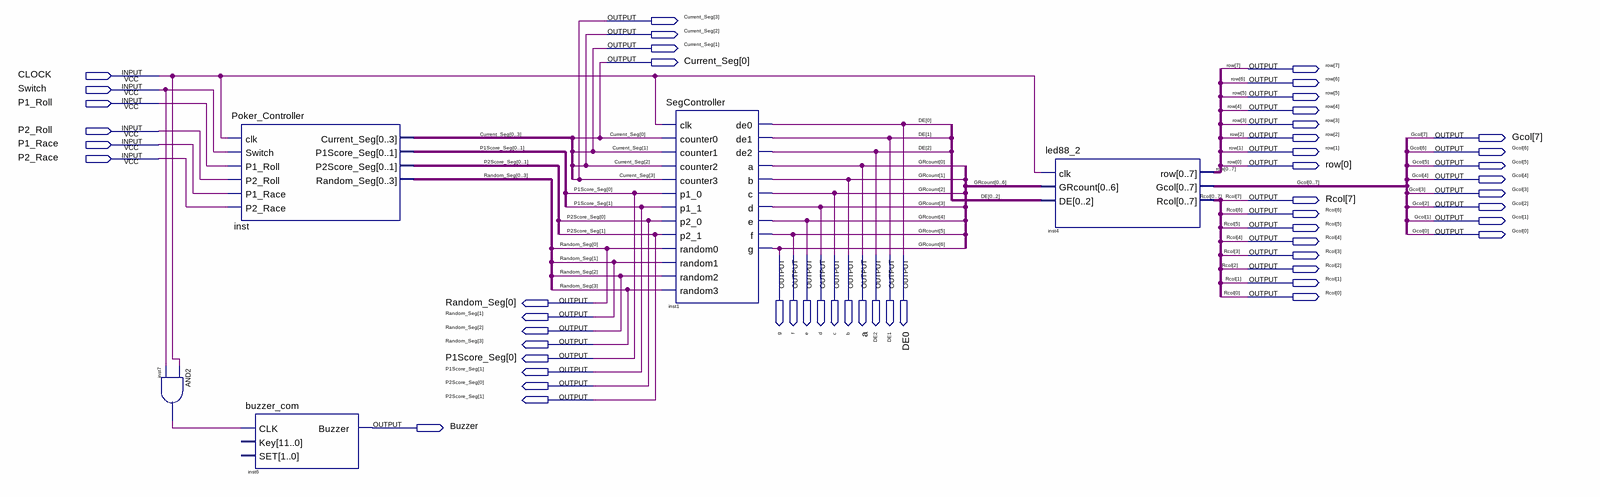
[diagram p0: schematic sheet]
// Quartus schematic Poker.bdf as structural Verilog: 5 symbols, 53 pins
module Poker (
  input  CLOCK,
  input  Switch,
  input  P1_Roll,
  input  P2_Roll,
  input  P1_Race,
  input  P2_Race,
  output [3:0] Current_Seg,
  output [7:0] row,
  output [7:0] Gcol,
  output [7:0] Rcol,
  output g,
  output f,
  output e,
  output d,
  output c,
  output b,
  output a,
  output DE2,
  output DE1,
  output DE0,
  output [3:0] Random_Seg,
  output [1:0] P1Score_Seg,
  output [1:0] P2Score_Seg,
  output Buzzer
);

  wire inst7_out;

  and inst7 (inst7_out, CLOCK, Switch);
  Poker_Controller inst (
    .clk(CLOCK), .Switch(Switch), .P1_Roll(P1_Roll), .P2_Roll(P2_Roll), .P1_Race(P1_Race), .P2_Race(P2_Race),
    .Current_Seg({Current_Seg[0], Current_Seg[1], Current_Seg[2], Current_Seg[3]}),
    .P1Score_Seg({P1Score_Seg[0], P1Score_Seg[1]}), .P2Score_Seg({P2Score_Seg[0], P2Score_Seg[1]}),
    .Random_Seg({Random_Seg[0], Random_Seg[1], Random_Seg[2], Random_Seg[3]}));
  buzzer_com inst6 (.CLK(inst7_out), .Buzzer(Buzzer));  // open: Key, SET
  SegController inst1 (
    .clk(CLOCK), .counter0(Current_Seg[0]), .counter1(Current_Seg[1]), .counter2(Current_Seg[2]),
    .counter3(Current_Seg[3]), .p1_0(P1Score_Seg[0]), .p1_1(P1Score_Seg[1]), .p2_0(P2Score_Seg[0]),
    .p2_1(P2Score_Seg[1]), .random0(Random_Seg[0]), .random1(Random_Seg[1]), .random2(Random_Seg[2]),
    .random3(Random_Seg[3]), .de0(DE0), .de1(DE1), .de2(DE2), .a(a), .b(b), .c(c), .d(d), .e(e), .f(f), .g(g));
  led88_2 inst4 (
    .clk(CLOCK), .GRcount({a, b, c, d, e, f, g}), .DE({DE0, DE1, DE2}),
    .row({row[0], row[1], row[2], row[3], row[4], row[5], row[6], row[7]}),
    .Gcol({Gcol[0], Gcol[1], Gcol[2], Gcol[3], Gcol[4], Gcol[5], Gcol[6], Gcol[7]}),
    .Rcol({Rcol[0], Rcol[1], Rcol[2], Rcol[3], Rcol[4], Rcol[5], Rcol[6], Rcol[7]}));

  // Other names for the same wires on the sheet: GRcount[6:0] = {g, f, e, d, c, b, a}
endmodule
